# Altium schematic sheet Top Level.SchDoc
size Letter; DocumentNumber: 1; SheetNumber: 1; SheetTotal: 3; DescLong1: ESE6710 Lab 3; DescLong2_DescShort: Class E Amplifier
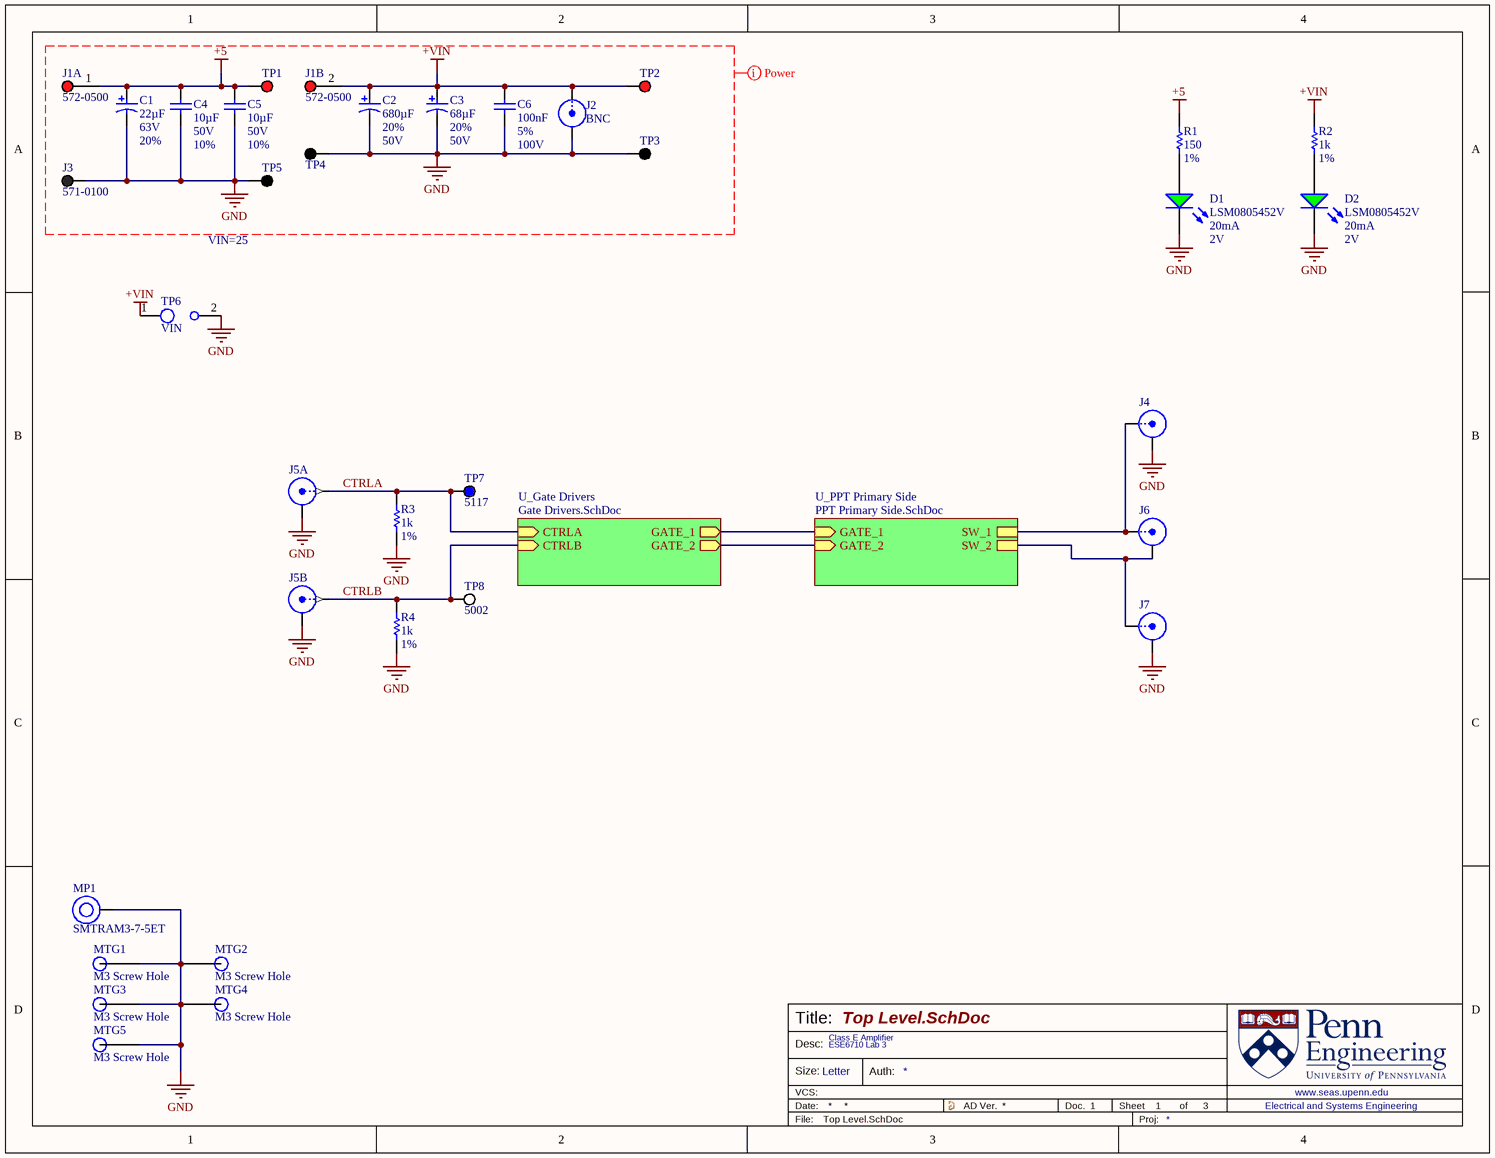
[diagram p0: Top Level.SchDoc]

## Parts
C1  value 22µF  Voltage: 63V  Tolerance: 20%  [CAPAE_D8H6_KEMET]  (hidden comment: A768KE226M1JLAE054)
C2  value 680µF  Tolerance: 20%  Voltage: 50V  [FP-RAD-TH-D_12_5_0_5-L_30-MFG]  (hidden comment: EEU-FC1H681L)
C3  value 68µF  Tolerance: 20%  Voltage: 50V  [FP-OS-CON-SMT-F12-MFG]  (hidden comment: 50SVPF68M)
C4  value 10µF  Voltage: 50V  Tolerance: 10%  [1206_CAP]  (hidden comment: CAP 1206 10UF 50V 10% X5R)
C5  value 10µF  Voltage: 50V  Tolerance: 10%  [1206_CAP]  (hidden comment: CAP 1206 10UF 50V 10% X5R)
C6  value 100nF  Tolerance: 5%  Voltage: 100V  [1206_CAP_75H_TDK]  (hidden comment: CAP 1206 0.1UF 100V 5% C0G)
D1  LSM0805452V  Current: 20mA  Forward Voltage: 2V  [LED_0805]
D2  LSM0805452V  Current: 20mA  Forward Voltage: 2V  [LED_0805]
J1  572-0500  [572-0500-Footprint-1]  (parts A,B of 2)
J2  BNC  [112404-Footprint-1]
J3  571-0100  [571-0100-Footprint-1]
J4  CON-SMA-EDGE-S  [FP-SMA-J-P-H-ST-EM1-MFG]  (value not drawn)
J5  031-6575  [031-6575-Footprint-1]  (value not drawn)  (parts A,B of 2)
J6  CON-SMA-EDGE-S  [FP-SMA-J-P-H-ST-EM1-MFG]  (value not drawn)
J7  CON-SMA-EDGE-S  [FP-SMA-J-P-H-ST-EM1-MFG]  (value not drawn)
MP1  SMTRAM3-7-5ET  [SMTRAM3-7-5ET-Footprint-1]
MTG1  M3 Screw Hole  [M3 Screw Hole-Footprint-1]  (no BOM)
MTG2  M3 Screw Hole  [M3 Screw Hole-Footprint-1]  (no BOM)
MTG3  M3 Screw Hole  [M3 Screw Hole-Footprint-1]  (no BOM)
MTG4  M3 Screw Hole  [M3 Screw Hole-Footprint-1]  (no BOM)
MTG5  M3 Screw Hole  [M3 Screw Hole-Footprint-1]  (no BOM)
R1  value 150  Tolerance: 1%  [0805_RES]  (hidden comment: RES 0805 150 1%)
R2  value 1k  Tolerance: 1%  [0805_RES]  (hidden comment: RES 0805 1K 1%)
R3  value 1k  Tolerance: 1%  [0805_RES]  (hidden comment: RES 0805 1K 1%)
R4  value 1k  Tolerance: 1%  [0805_RES]  (hidden comment: RES 0805 1K 1%)
TP1  5280  [KSTN-5010_V]  (value not drawn)
TP2  5280  [KSTN-5010_V]  (value not drawn)
TP3  5281  [KSTN-5011_V]  (value not drawn)
TP4  5281  [KSTN-5011_V]  (value not drawn)
TP5  5281  [KSTN-5011_V]  (value not drawn)
TP6  NetName: VIN  [No Silk Test Point - Scope with Ground Spring-Footprint-1]  (hidden comment: Test Point - Scope with Ground Spring (No Socket))  (no BOM)
TP7  5117  [KSTN-5117]
TP8  5002  [KSTN-5002]

## Sub-sheets
U_Gate Drivers = Gate Drivers.SchDoc: CTRLB (in), CTRLA (in), GATE_2 (out), GATE_1 (out)
U_PPT Primary Side = PPT Primary Side.SchDoc: GATE_1 (in), GATE_2 (in), SW_1, SW_2

## Nets
+5: C1.1 C4.1 C5.1 J1.1 R1.2 TP1.1
+VIN: C2.1 C3.1 C6.2 J1.2 J2.1 R2.2 TP2.1 TP6.1(Signal)
GND: C1.2 C2.2 C3.2 C4.2 C5.2 C6.1 D1.K D2.K J2.2(SHELL) J3.1 J4.2(SHELL) J5.2(SHELL) J5.4(SHELL) J7.2(SHELL) MP1.1 MTG1.1 MTG2.1 MTG3.1 MTG4.1 MTG5.1 R3.1 R4.1 TP3.1 TP4.1 TP5.1 TP6.2(GND)
CTRLA: J5.1 R3.2 TP7.1 ; sheet U_Gate Drivers/CTRLA
CTRLB: J5.3 R4.2 TP8.1 ; sheet U_Gate Drivers/CTRLB
NetD1_A: D1.A R1.1
NetD2_A: D2.A R2.1
NetJ4_1: J4.1 J6.1 ; sheet U_PPT Primary Side/SW_1
NetJ6_2: J6.2(SHELL) J7.1 ; sheet U_PPT Primary Side/SW_2
(unnamed): sheet U_Gate Drivers/GATE_2, sheet U_PPT Primary Side/GATE_2
(unnamed): sheet U_Gate Drivers/GATE_1, sheet U_PPT Primary Side/GATE_1

## Layout directives
net class Power: +5, +VIN, GND

## Notes on the sheet
- VIN=25
- Title:
- Desc:
- Size:
- Letter
- Auth:
- Sheet
- of
- www.seas.upenn.edu
- Electrical and Systems Engineering
- Proj:

## Library data of the parts
C1 = CMP-0001-00000-1: Aluminum Electrolytic Polymer Capacitor, Polarized, 63V, 20% +Tol, 20% -Tol, 22uF, Surface Mount, 3333; Capacitor Type: Aluminum Polymer; Courses: ESE5800; RoHS: Yes; Mount: SMD; RoHS Compliant: Yes; Case/Package: CAPAE; Pins: 2
C2 = CMP-0001-00015-2: Aluminum Electrolytic Capacitor, Polarized, Aluminum (wet), 50V, 20% +Tol, 20% -Tol, 680uF, Through Hole Mount; Dielectric Material: Aluminium; Ripple Current: 1.66125A; Tan Delta: 0.1; Leakage Current: 340uA; Reference Standard: AEC-Q200; Reach SVHC Compliant: Yes; Pins: 2; Package Style: RadialMeter; Termination: Wire; Tolerance (fill in as +-): 20%; Capacitor Type: Aluminium; Tolerance  (fill in as +-): 20%; Case/Package: CAPAE 5L12.5D30H; Mount: SMD; Length: 30mm; Rated DC Voltage (URdc): 50V; Mounting Technology: Through Hole; RoHS: Yes; Terminal Pitch: 5mm; JESD-609 Code: e3; Diameter: 12.5mm; Max Operating Temperature: 105°C; Terminal Finish: Tin; Polarity: Polarized; Min Operating Temperature: -55°C; RoHS Compliant: Yes
C3 = CMP-001-00041-1: Cap Aluminum Polymer 68uF 50VDC 20%( 10 X 12.6mm) SMD 0.02 Ohm 4300mA 5000h 105C T/R; Part Series: SVPF; Manufacturer Lifecycle Status: ACTIVE; Polarity: Polar; Leakage Current: 680µA; Ripple Current: 215mA; Dissipation Factor: 12%; Ripple Current (AC): 4.3A; Life (Hours): 5000hours; Capacitor Type: Aluminium; ESR (Equivalent Series Resistance): 20mΩ; Min Operating Temperature: -55°C; Voltage Rating: 50V; Case/Package: Radial; Diameter: 10mm; Length: 10.3mm; Voltage Rating (DC): 50V; Pins: 12; Lead Free: Lead Free; Number of Terminals: 2; Height: 12.6mm; Material: Polymer; Mounting Technology: Surface Mount; REACH SVHC: Yes; Mount: SMD; Width: 10.3mm; Termination: SMD/SMT; Schedule B: 8532220020, 8532220020; Lifecycle Status: Production; Max Operating Temperature: 105°C; RoHS: Compliant; Height - Seated (Max): 12.7mm
C4 C5 = CMP-001-00003-6: Capacitor Surface Mount 1206 Footprint 10UF 25V 10% Tolerance Ceramic X5R; Manufacturer: Various; PCB Package: 1206; Description in Visual: Cap SMT 1206 10UF 50V 10%  Cer X5R; Case/Package: 1206; RoHS: Yes; JLCPCB Part #: C13585; Manufacturer P/N: CAP 1206 10UF 50V 10% X5R; P/N: CAP 1206 10UF 50V 10% X5R; Type: Ceramic X5R; Capacitor Type: Ceramic; Mount: SMT
C6 = CMP-001-00037-1: 100V 100nF C0G 卤5% 1206 Multilayer Ceramic Capacitors MLCC - SMD/SMT ROHS; Manufacturer Lifecycle Status: PRODUCTION; Temperature Coefficient: 30ppm/°C; Type: Ceramic C0G; PCB Package: 1206; Case Code (Imperial): 1206; Material: Ceramic; Thickness: 1.8034mm; Dielectric: C0G; Min Width: 1.4mm; China RoHS: Compliant; Width: 1.6mm; Schedule B: 8532240020, 8532240020; Voltage Rating (DC): 100V; REACH SVHC: Yes; Max Length: 3.4mm; Lifecycle Status: Production; Case/Package: 1206; Case Code (Metric): 3216; Weight: 16.187578mg; Mounting Technology: Surface Mount; Min Operating Temperature: -55°C; RoHS: Compliant; Length: 3.2mm; Capacitor Type: Ceramic; Termination: SMD/SMT; Number of Terminals: 2; Height: 1.6mm; Mount: SMT; Max Operating Temperature: 125°C; Packaging: Tape & Reel (TR); Voltage Rating: 100V; Min Length: 3mm; Dielectric Material: Ceramic; Max Width: 1.8mm
D1 D2 = CMP-00038-4: Single Color LED, Green, 0805; Wavelength - Peak: 571nm; Package (Case): 0805; RoHS Compliant: Yes; Wavelength - Dominant: 571nm; Color: Green; Test Current: 20mA
J1 = CMP-00800-2: Banana Jack, Red, Dual, 50V (Working), 10A, 1.94MM Rohs Compliant: Yes; Voltage Rating: 250V; Number of Contacts: 2; Body Material: Acetal; Gender: Female; Contact Material: Brass; Color: Red; Termination: Solder; Current Rating: 10A; Radiation Hardening: No; Insulation Material: Acetal; Orientation: Right Angle; REACH SVHC: No; Length: 29.7mm; RoHS: Compliant; Contact Plating: Silver; Operating Supply Voltage: 50V; Mounting Technology: Through Hole; Case/Package: 0500
J2 = CMP-00805-2: BNC Connector Jack, Female Socket 50 Ohms Through Hole Solder; Body Plating: Nickel; Body Material: Brass; Frequency: 3GHz; Connector Type: BNC, Coaxial, Receptacle, Socket; Voltage Rating: 500V; Clock Frequency: 4GHz; Impedance: 50Ω; Gender: Male; Value: 50Ω; Insulation Resistance: 5GΩ; Orientation: Straight; Contact Gender: Female; Fastening Type: Bayonet; Contact Plating: Gold; Housing Color: Silver; Max Operating Temperature: 165°C; Mounting Technology: PCB, Through Hole; Contact Material: Bronze; Insulation Material: Polytetrafluoroethylene; REACH SVHC: Unknown; Termination: Solder; Weight: 4.025009g; Lead Free: Lead Free; Min Operating Temperature: -65°C; Lifecycle Status: Production; RoHS: Compliant; Radiation Hardening: No
J3 = CMP-002-00000-3: Banana Jack, Black; pin to pad: 1>1A+1B
J4 J6 J7 = CMP-00788-5: Sma Female Connector Jack, Pcb Edge Mount Rohs Compliant: Yes; Number of Ports: 1; Impedance: 50Ω; Frequency: 18GHz; Pins: 1; Shell Material: Brass; Case/Package: SMA; Height: 6.35mm; RoHS: Compliant; Contact Gender: Female; Number of Contacts: 1; Contact Material: Gold; Manufacturer Package Identifier: CON-SMA-EDGE-S
J5 = CMP-00819-1: RF / Coaxial Connector, BNC Coaxial, Right Angle Jack, Through Hole Right Angle, 50 ohm; Frequency: 1GHz; Impedance: 50Ω; Body Material: Zinc; Gender: Male; Number of Ports: 2; Body Plating: Nickel; Connector Type: BNC, Coaxial, Connector; Dielectric Material: Polypropylene; Polarity: Standard; Rule: UNIONINDEX=0|RULEKIND=PolygonConnect|NETSCOPE=AnyNet|LAYERKIND=SameLayer|NAME=Schematic Polygon Connect Style|CONNECTSTYLE=Relief|RELIEFCONDUCTORWIDTH=10mil|RELIEFENTRIES=4|POLYGONRELIEFANGLE=90 Angle|AIRGAPWIDTH=10mil|UNIT=Imperial; Contact Material: Bronze; Termination: Solder; Mounting Technology: Bulkhead, Panel, Through Hole; Radiation Hardening: No; Lifecycle Status: Production; Clock Frequency: 1GHz; Orientation: Right Angle; REACH SVHC: Unknown; Max Operating Temperature: 85°C; RoHS: Compliant; Lead Free: Lead Free; Contact Gender: Female; Contact Plating: Gold; Min Operating Temperature: -55°C
MP1 = CMP-00808-2: Surface Mount Rangle M3 Electro-plated Tin; RoHS: Compliant; REACH SVHC: Yes; Lifecycle Status: Production
MTG1-MTG5 = CMP-00028-5: Close clearance Fit for M3 Screw Hole; PCB Mounting for M3 Screw
R1 = CMP-005-004245-3: Resistor Surface Mount, 150 Ohms, 0805 Footprint, 1% Tolerance 0.125W; Manufacturer: Various; Manufacturer P/N: RES 0805 150R 1%; Description in Visual: Res SMT 150 0805  1%  0.125W; PCB Package: 0805; Power Rating: 0.125W; Mount: SMT
R2-R4 = CMP-005-004398-3: Resistor Surface Mount, 1K Ohms, 0805 Footprint, 1% Tolerance 0.125W; Manufacturer: Various; Description in Visual: Res SMT 1K 0805  1%  0.125W; PCB Package: 0805; Mount: SMT; Manufacturer P/N: RES 0805 1K 1%; JLCPCB Part #: C17513; Power Rating: 0.125W
TP1 TP2 = CMP-00794-2: Red PC Test Point, Multipurpose Phosphor Bronze Silver Plating Through Hole Mounting Type, 5010, 5280, Testpoint; Hole Diameter: 1.6mm; Inside Diameter: 1.78mm; Number of Ports: 1; Body Material: PBT; Length: 11.3mm; Orientation: Straight; REACH SVHC: Yes; Material: Bronze, Nylon, Silver; Height: 8.12mm; Mounting Technology: Through Hole; Packaging: Bulk; Lead Free: Lead Free; Contact Plating: Silver; Contact Material: Bronze; Termination: Through Hole; Housing Color: Red; Color: Red; Lifecycle Status: Production; Flammability Rating: UL94 V-0; RoHS: Compliant
TP3-TP5 = CMP-024-000010-4: Test Point, Black, Multipurpose PCB TEST POINT BLACK MULTIPURPOSE 5011 5281; Testpoint
TP6 = CMP-00799-3: Testpoint for scope probe with a ground spring; Probe tip 0.032in-0.046in; 0.350in Ground Spring Clearance (placed at 0.3in)
TP7 = CMP-024-000007-1: Test Point, Blue, 1-Pin THD, RoHS, Bulk; Brand: KeystoneElectronics; Plating: Silver; Mounting Hole Size: 1mm; Outside Diameter: 2.54mm; Pin Count: 1; Datasheet Version: Rev. G, 12/2008; Product: TestPoints; Datasheet URL: https://ciiva.com/datasheet-click-2917627?src=ciiva&sig=bd195616; Color: Blue; Length: 7.62mm; Type: Miniature; Product Category: CircuitBoardHardware-PCB; Component Type: Standard; Packaging: Bulk; Material: Nylon; RoHS: True; Contact Material: PhosphorBronze; Manufacturer URL: http://www.keyelco.com/; Source: Keystone 500x Series.SchLib; Manufacturer: KeystoneElectronics; Design Item ID: 5117
TP8 = CMP-024-000002-1: Test Point, White, 1-Pin THD, RoHS, Bulk; Manufacturer: KeystoneElectronics; Mounting Hole Size: 1mm; Plating: Silver; Outside Diameter: 2.54mm; Product Category: CircuitBoardHardware-PCB; RoHS: True; Manufacturer URL: http://www.keyelco.com/; Packaging: Bulk; Source: Keystone 500x Series.SchLib; Component Type: Standard; Pin Count: 1; Material: Nylon; Datasheet Version: Rev. G, 12/2008; Design Item ID: 5002; Color: White; Product: TestPoints; Type: Miniature; Contact Material: PhosphorBronze; Datasheet URL: https://ciiva.com/datasheet-click-2917627?src=ciiva&sig=bd195616; Length: 7.62mm; Brand: KeystoneElectronics